# Altium project BTB.PrjPcb (part 2 of 2)
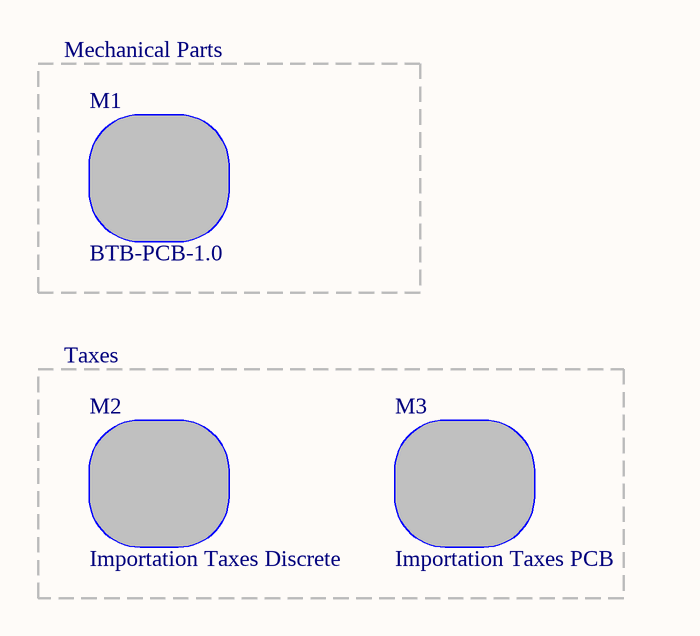
[diagram p14: ProductComponents.SchDoc]

## Nets that join several sheets
1V_VREF: SpeedACQ (R72.1 R73.2), PowerSupplies (C32.1 D6.3 R58.2)
4V5_VREF: TemperatureACQ (C40.2 U12.2 U12.6), ForceACQ (C2.2 U2.2 U2.6), PowerSupplies (C30.1 C31.1 D5.2)
5V: TemperatureACQ (10 pins), ForceACQ (10 pins), VibrationACQ (C58.1 R105.2 U16.5), SpeedACQ (5 pins), PowerSupplies (6 pins), MCU (C18.2 L3.2 U5.4 U5.6), PwmOut (C33.2 U9.8), DigitalInterfaces (6 pins), Connectors (6 pins), Leds (C17.2 R51.2 R52.2 U4.9), ExtraADC (R57.2 R59.2)
5V_USB: Connectors (L1.1), USB (C56.2 U14.1 U15.1)
10V_VREF: PowerSupplies (5 pins), Connectors (C8.2 C9.2 P1.4 P1.9)
GND: TemperatureACQ (23 pins), ForceACQ (15 pins), VibrationACQ (12 pins), SpeedACQ (16 pins), PowerSupplies (19 pins), MCU (8 pins), PwmOut (7 pins), DigitalInterfaces (12 pins), Connectors (30 pins), Leds (12 pins), USB (C56.1 C57.1 U14.14 U15.6), ExtraADC (R16.1 R18.1)
RST: MCU (U5.29), Connectors (D1.1 P5.5 R2.1), USB (U14.4)
VIN: PowerSupplies (D2.1 TZ7.2), Connectors (P1.2)
NetC6_2: VibrationACQ (R100.1 R103.1 TZ15.2), Connectors (C6.2 P6.1 P6.3 P6.5)
NetC36_1: PwmOut (C36.1 R61.2 R65.2 TZ8.2), Connectors (P4.14)
NetC38_2: SpeedACQ (C38.2 C39.2 R69.2), MCU (U5.23)
NetP1_5: ForceACQ (R26.1 TZ5.1 U1.2), Connectors (P1.5)
NetP1_6: ForceACQ (TZ5.2 U1.3), Connectors (P1.6)
NetP1_10: ForceACQ (R34.1 TZ6.1 U3.2), Connectors (P1.10)
NetP1_11: ForceACQ (TZ6.2 U3.3), Connectors (P1.11)
NetP2_1: Connectors (P2.1), Leds (R53.2)
NetP2_2: Connectors (P2.2), Leds (R49.2)
NetP2_3: Connectors (P2.3), Leds (R50.2)
NetP2_4: Connectors (P2.4), Leds (R35.2)
NetP2_5: Connectors (P2.5), Leds (R36.2)
NetP2_6: Connectors (P2.6), Leds (R37.2)
NetP2_7: Connectors (P2.7), Leds (R38.2)
NetP2_8: Connectors (P2.8), Leds (R39.2)
NetP2_9: Connectors (P2.9), Leds (R40.2)
NetP2_10: Connectors (P2.10), Leds (R41.2)
NetP2_12: Connectors (P2.12), ExtraADC (R15.1)
NetP2_14: Connectors (P2.14), ExtraADC (R17.2)
NetP3_2: Connectors (P3.2), USB (U15.5)
NetP3_3: Connectors (P3.3), USB (U15.4)
NetP3_7: VibrationACQ (R106.2 R107.1 TZ16.2), Connectors (P3.7)
NetP3_12: SpeedACQ (R68.1 TZ9.2), Connectors (P3.12)
NetP3_13: SpeedACQ (R75.1 R76.1 TZ10.2), Connectors (P3.13)
NetP4_1: TemperatureACQ (R81.1 TZ11.1), Connectors (P4.1)
NetP4_2: TemperatureACQ (R85.1 R86.2 TZ12.2), Connectors (P4.2)
NetP4_3: TemperatureACQ (R90.1 TZ13.1), Connectors (P4.3)
NetP4_4: TemperatureACQ (R94.1 R95.2 TZ14.2), Connectors (P4.4)
NetP4_5: DigitalInterfaces (Q2.2 R8.2 TZ2.2), Connectors (P4.5)
NetP4_7: DigitalInterfaces (Q4.2 R14.2 TZ4.2), Connectors (P4.7)
NetP4_9: DigitalInterfaces (R3.1 TZ1.2), Connectors (P4.9)
NetP4_11: DigitalInterfaces (R9.1 TZ3.2), Connectors (P4.11)
NetP5_1: MCU (U5.16), DigitalInterfaces (Q3.2 R11.2), Connectors (P5.1)
NetP5_3: MCU (U5.17), Connectors (P5.3), Leds (R48.2 U4.7)
NetP5_4: MCU (U5.15), DigitalInterfaces (Q1.2 R6.2), Connectors (P5.4)
NetQ5_2: Leds (Q5.2 R51.1), USB (U14.3)
NetQ5_5: Leds (Q5.5 R52.1), USB (U14.2)
NetQ6_3: SpeedACQ (Q6.3 R74.1), MCU (U5.32), Leds (R47.2 U4.6)
NetQ7_3: VibrationACQ (Q7.3 R105.1), MCU (U5.12), Leds (R42.2 U4.1)
NetR7_1: MCU (U5.13), DigitalInterfaces (R7.1)
NetR13_1: MCU (U5.14), DigitalInterfaces (R13.1)
NetR15_2: MCU (U5.19), ExtraADC (R15.2 R16.2 R57.1)
NetR17_1: MCU (U5.22), ExtraADC (R17.1 R18.2 R59.1)
NetR19_2: ForceACQ (R19.2 R25.1 U2.1), MCU (U5.10), Leds (R44.2 U4.3)
NetR20_2: ForceACQ (R20.2), MCU (U5.26)
NetR27_2: ForceACQ (R27.2 R33.1 U2.7), MCU (U5.11), Leds (R43.2 U4.2)
NetR28_2: ForceACQ (R28.2), MCU (U5.27)
NetR45_2: TemperatureACQ (R87.2 R93.1 U12.7), MCU (U5.2), Leds (R45.2 U4.4)
NetR46_2: TemperatureACQ (R78.2 R84.1 U12.1), MCU (U5.1), Leds (R46.2 U4.5)
NetR64_1: MCU (U5.9), PwmOut (R64.1 R66.2)
NetR79_1: TemperatureACQ (R79.1), MCU (U5.24)
NetR88_1: TemperatureACQ (R88.1), MCU (U5.25)
NetR96_2: MCU (U5.31), USB (R96.2)
NetR97_2: MCU (U5.30), USB (R97.2)
NetR99_1: VibrationACQ (R99.1), MCU (U5.28)

## Assembly variants
BoM-Full-Functionality: not fitted C3 C4 C5 C6 C9 C28 C29 C31 C36 C39 D1 L8 P1 P2 P3 P4 R1 R4 R10 R15 R16 R17 R18 R21 R25 R29 R33 R56 R65 R67 R70 R71 R76 R80 R84 R89 R93 R96 R97 R101 R103 R107 U8
BoM-Basic-Functionality: not fitted C3 C4 C5 C6 C10 C11 C15 C16 C28 C29 C31 C33 C34 C35 C36 C39 C51 C52 C53 C54 C55 D1 P1 P2 P3 P4 Q1 Q3 Q5 R1 R3 R4 R6 R9 R10 R11 R15 R16 R17 R18 R21 R25 R28 R30 R31 R32 R33 R34 R38 R40 R43 R45 R49 R50 R51 R52 R56 R61 R62 R63 R64 R65 R66 R67 R70 R71 R76 R80 R84 R88 R90 R91 R92 R93 R94 R95 TZ1 TZ3 TZ6 TZ8 TZ13 TZ14 U3 U8 U9 U13